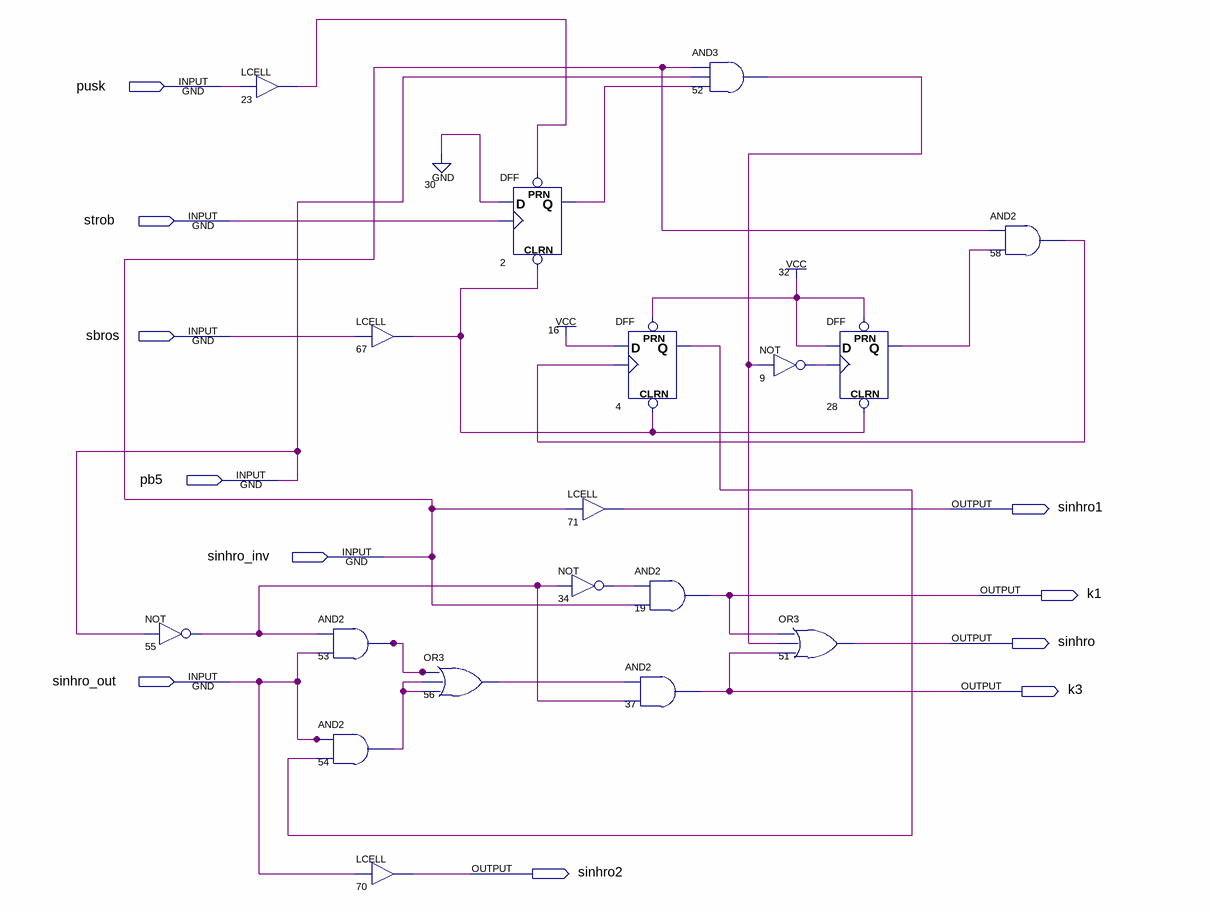
[diagram p0: schematic sheet]
// Quartus schematic pusk6des.bdf as structural Verilog: 18 symbols, 11 pins
module pusk6des (
  input  pusk,
  input  strob,
  input  sbros,
  input  pb5,
  input  sinhro_inv,
  input  sinhro_out,
  output sinhro1,
  output k1,
  output sinhro,
  output k3,
  output sinhro2
);

  wire n2_q, n4_q, n9_out, n23_out, n28_q, n34_out, n52_out, n53_out, n54_out, n55_out, n56_out, n58_out,
       n67_out;

  not u_55 (n55_out, pb5);
  LCELL u_23 (.IN(pusk), .OUT(n23_out));
  LCELL u_67 (.IN(sbros), .OUT(n67_out));
  and u_53 (n53_out, n55_out, sinhro_out);
  and u_54 (n54_out, sinhro_out, n4_q);
  LCELL u_70 (.IN(sinhro_out), .OUT(sinhro2));
  or u_56 (n56_out, n53_out, n54_out, n54_out);
  DFF u_2 (.CLRN(n67_out), .CLK(strob), .D(1'b0), .PRN(n23_out), .Q(n2_q));
  LCELL u_71 (.IN(sinhro_inv), .OUT(sinhro1));
  not u_34 (n34_out, n55_out);
  DFF u_4 (.CLRN(n67_out), .CLK(n58_out), .D(1'b1), .PRN(1'b1), .Q(n4_q));
  and u_19 (k1, n34_out, sinhro_inv);
  and u_37 (k3, n56_out, n55_out);
  and u_52 (n52_out, sinhro_inv, pb5, n2_q);
  not u_9 (n9_out, n52_out);
  DFF u_28 (.CLRN(n67_out), .CLK(n9_out), .D(1'b1), .PRN(1'b1), .Q(n28_q));
  or u_51 (sinhro, k1, n52_out, k3);
  and u_58 (n58_out, sinhro_inv, n28_q);
endmodule
